# Altium schematic sheet MLVDS_Transceivers.SchDoc: RFSoC AMC
size 420 x 297 mm; CompanyName: WUT; DrawnBy: T. Przywozki; Organization: WUT ISE; Address1: Warsaw University of Technology; Address2: Nowowiejska 15/19 00-665 Warsaw; Address3: Tomasz.Przywozki@pw.edu.pl; DocumentNumber: 44; Revision: 1; SheetNumber: 44; SheetTotal: 45; Project: RFSoC AMC; ModifiedBy: T. Przywozki; CreateDate: -; CheckedDate: -; DivGrp: ISE; Designer: T. Przywozki; ModifiedDate: -; ProjectName: ADC/DAC MEZZANINE
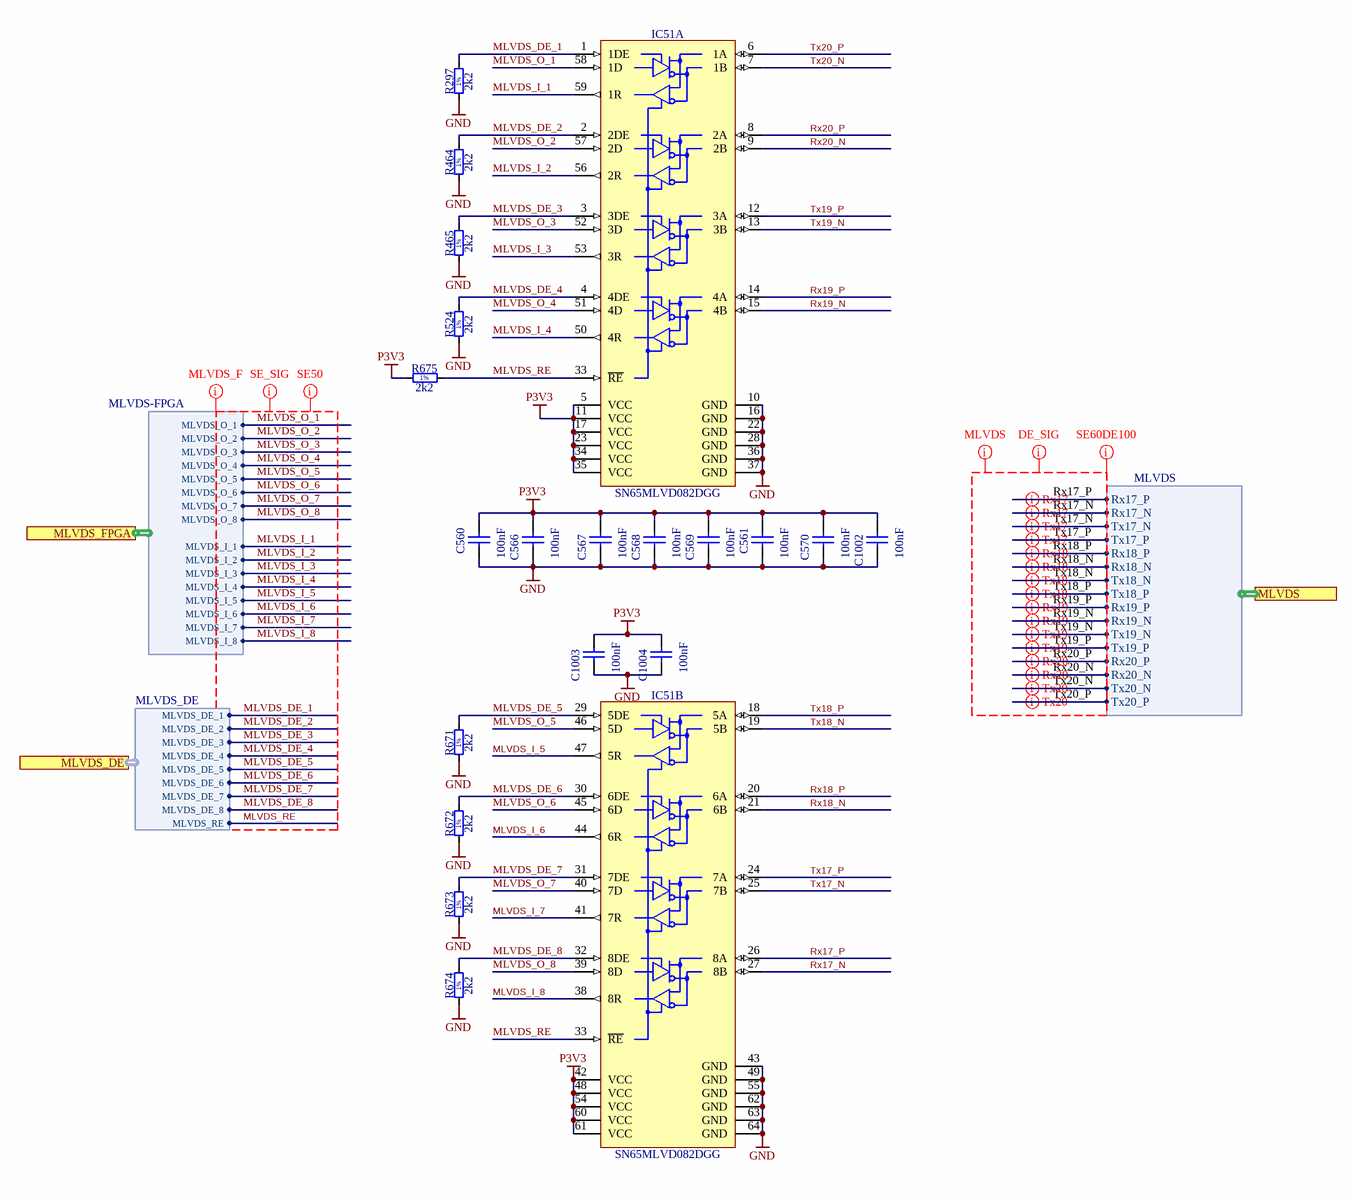
[diagram p0: MLVDS_Transceivers.SchDoc]

## Parts
C560  100nF  [CAPC0603X33N]
C561  100nF  [CAPC0603X33N]
C566  100nF  [CAPC0603X33N]
C567  100nF  [CAPC0603X33N]
C568  100nF  [CAPC0603X33N]
C569  100nF  [CAPC0603X33N]
C570  100nF  [CAPC0603X33N]
C1002  100nF  [CAPC0603X33N]
C1003  100nF  [CAPC0603X33N]
C1004  100nF  [CAPC0603X33N]
IC51  SN65MLVD082DGG  [SOP50P810X120-64N]  (parts A,B of 2)
R297  2k2  [RESC1005X40N]
R464  2k2  [RESC1005X40N]
R465  2k2  [RESC1005X40N]
R524  2k2  [RESC1005X40N]
R671  2k2  [RESC1005X40N]
R672  2k2  [RESC1005X40N]
R673  2k2  [RESC1005X40N]
R674  2k2  [RESC1005X40N]
R675  2k2  [RESC1005X40N]

## Ports
MLVDS (harness MLVDS), MLVDS_DE (harness MLVDS_DE), MLVDS_FPGA (harness MLVDS-FPGA)

## Harnesses
MLVDS: Rx17_P, Rx17_N, Tx17_N, Tx17_P, Rx18_P, Rx18_N, Tx18_N, Tx18_P, Rx19_P, Rx19_N, Tx19_N, Tx19_P, Rx20_P, Rx20_N, Tx20_N, Tx20_P
MLVDS-FPGA: MLVDS_O_1, MLVDS_O_2, MLVDS_O_3, MLVDS_O_4, MLVDS_O_5, MLVDS_O_6, MLVDS_O_7, MLVDS_O_8, MLVDS_I_1, MLVDS_I_2, MLVDS_I_3, MLVDS_I_4, MLVDS_I_5, MLVDS_I_6, MLVDS_I_7, MLVDS_I_8
MLVDS_DE: MLVDS_DE_1, MLVDS_DE_2, MLVDS_DE_3, MLVDS_DE_4, MLVDS_DE_5, MLVDS_DE_6, MLVDS_DE_7, MLVDS_DE_8, MLVDS_RE

## Nets
GND: C560.2 C561.2 C566.2 C567.2 C568.2 C569.2 C570.2 C1002.2 C1003.2 C1004.2 IC51.10(GND) IC51.16(GND) IC51.22(GND) IC51.28(GND) IC51.36(GND) IC51.37(GND) IC51.43(GND) IC51.49(GND) IC51.55(GND) IC51.62(GND) IC51.63(GND) IC51.64(GND) R297.1 R464.1 R465.1 R524.1 R671.1 R672.1 R673.1 R674.1
P3V3: C560.1 C561.1 C566.1 C567.1 C568.1 C569.1 C570.1 C1002.1 C1003.1 C1004.1 IC51.5(VCC) IC51.11(VCC) IC51.17(VCC) IC51.23(VCC) IC51.34(VCC) IC51.35(VCC) IC51.42(VCC) IC51.48(VCC) IC51.54(VCC) IC51.60(VCC) IC51.61(VCC) R675.1
MLVDS_DE_1: IC51.1(1DE) R297.2 ; port MLVDS_DE.MLVDS_DE_1
MLVDS_DE_2: IC51.2(2DE) R464.2 ; port MLVDS_DE.MLVDS_DE_2
MLVDS_DE_3: IC51.3(3DE) R465.2 ; port MLVDS_DE.MLVDS_DE_3
MLVDS_DE_4: IC51.4(4DE) R524.2 ; port MLVDS_DE.MLVDS_DE_4
MLVDS_DE_5: IC51.29(5DE) R671.2 ; port MLVDS_DE.MLVDS_DE_5
MLVDS_DE_6: IC51.30(6DE) R672.2 ; port MLVDS_DE.MLVDS_DE_6
MLVDS_DE_7: IC51.31(7DE) R673.2 ; port MLVDS_DE.MLVDS_DE_7
MLVDS_DE_8: IC51.32(8DE) R674.2 ; port MLVDS_DE.MLVDS_DE_8
MLVDS_I_1: IC51.59(1R) ; port MLVDS_FPGA.MLVDS_I_1
MLVDS_I_2: IC51.56(2R) ; port MLVDS_FPGA.MLVDS_I_2
MLVDS_I_3: IC51.53(3R) ; port MLVDS_FPGA.MLVDS_I_3
MLVDS_I_4: IC51.50(4R) ; port MLVDS_FPGA.MLVDS_I_4
MLVDS_I_5: IC51.47(5R) ; port MLVDS_FPGA.MLVDS_I_5
MLVDS_I_6: IC51.44(6R) ; port MLVDS_FPGA.MLVDS_I_6
MLVDS_I_7: IC51.41(7R) ; port MLVDS_FPGA.MLVDS_I_7
MLVDS_I_8: IC51.38(8R) ; port MLVDS_FPGA.MLVDS_I_8
MLVDS_O_1: IC51.58(1D) ; port MLVDS_FPGA.MLVDS_O_1
MLVDS_O_2: IC51.57(2D) ; port MLVDS_FPGA.MLVDS_O_2
MLVDS_O_3: IC51.52(3D) ; port MLVDS_FPGA.MLVDS_O_3
MLVDS_O_4: IC51.51(4D) ; port MLVDS_FPGA.MLVDS_O_4
MLVDS_O_5: IC51.46(5D) ; port MLVDS_FPGA.MLVDS_O_5
MLVDS_O_6: IC51.45(6D) ; port MLVDS_FPGA.MLVDS_O_6
MLVDS_O_7: IC51.40(7D) ; port MLVDS_FPGA.MLVDS_O_7
MLVDS_O_8: IC51.39(8D) ; port MLVDS_FPGA.MLVDS_O_8
MLVDS_RE: IC51.33(~{RE}) R675.2 ; port MLVDS_DE.MLVDS_RE
Rx17_N: IC51.27(8B) ; port MLVDS.Rx17_N
Rx17_P: IC51.26(8A) ; port MLVDS.Rx17_P
Rx18_N: IC51.21(6B) ; port MLVDS.Rx18_N
Rx18_P: IC51.20(6A) ; port MLVDS.Rx18_P
Rx19_N: IC51.15(4B) ; port MLVDS.Rx19_N
Rx19_P: IC51.14(4A) ; port MLVDS.Rx19_P
Rx20_N: IC51.9(2B) ; port MLVDS.Rx20_N
Rx20_P: IC51.8(2A) ; port MLVDS.Rx20_P
Tx17_N: IC51.25(7B) ; port MLVDS.Tx17_N
Tx17_P: IC51.24(7A) ; port MLVDS.Tx17_P
Tx18_N: IC51.19(5B) ; port MLVDS.Tx18_N
Tx18_P: IC51.18(5A) ; port MLVDS.Tx18_P
Tx19_N: IC51.13(3B) ; port MLVDS.Tx19_N
Tx19_P: IC51.12(3A) ; port MLVDS.Tx19_P
Tx20_N: IC51.7(1B) ; port MLVDS.Tx20_N
Tx20_P: IC51.6(1A) ; port MLVDS.Tx20_P

## Layout directives
differential pair: Rx17_N, Rx17_P, Rx18_N, Rx18_P, Rx19_N, Rx19_P, Rx20_N, Rx20_P, Tx17_N, Tx17_P, Tx18_N, Tx18_P, Tx19_N, Tx19_P, Tx20_N, Tx20_P
net class MLVDS: Rx17_N, Rx17_P, Rx18_N, Rx18_P, Rx19_N, Rx19_P, Rx20_N, Rx20_P, Tx17_N, Tx17_P, Tx18_N, Tx18_P, Tx19_N, Tx19_P, Tx20_N, Tx20_P
net class DE_SIG: Rx17_N, Rx17_P, Rx18_N, Rx18_P, Rx19_N, Rx19_P, Rx20_N, Rx20_P, Tx17_N, Tx17_P, Tx18_N, Tx18_P, Tx19_N, Tx19_P, Tx20_N, Tx20_P
net class SE60DE100: Rx17_N, Rx17_P, Rx18_N, Rx18_P, Rx19_N, Rx19_P, Rx20_N, Rx20_P, Tx17_N, Tx17_P, Tx18_N, Tx18_P, Tx19_N, Tx19_P, Tx20_N, Tx20_P
net class MLVDS_F: MLVDS_DE_1, MLVDS_DE_2, MLVDS_DE_3, MLVDS_DE_4, MLVDS_DE_5, MLVDS_DE_6, MLVDS_DE_7, MLVDS_DE_8, MLVDS_I_1, MLVDS_I_2, MLVDS_I_3, MLVDS_I_4, MLVDS_I_5, MLVDS_I_6, MLVDS_I_7, MLVDS_I_8, MLVDS_O_1, MLVDS_O_2, MLVDS_O_3, MLVDS_O_4, MLVDS_O_5, MLVDS_O_6, MLVDS_O_7, MLVDS_O_8, MLVDS_RE
net class SE50: MLVDS_DE_1, MLVDS_DE_2, MLVDS_DE_3, MLVDS_DE_4, MLVDS_DE_5, MLVDS_DE_6, MLVDS_DE_7, MLVDS_DE_8, MLVDS_I_1, MLVDS_I_2, MLVDS_I_3, MLVDS_I_4, MLVDS_I_5, MLVDS_I_6, MLVDS_I_7, MLVDS_I_8, MLVDS_O_1, MLVDS_O_2, MLVDS_O_3, MLVDS_O_4, MLVDS_O_5, MLVDS_O_6, MLVDS_O_7, MLVDS_O_8, MLVDS_RE
net class SE_SIG: MLVDS_DE_1, MLVDS_DE_2, MLVDS_DE_3, MLVDS_DE_4, MLVDS_DE_5, MLVDS_DE_6, MLVDS_DE_7, MLVDS_DE_8, MLVDS_I_1, MLVDS_I_2, MLVDS_I_3, MLVDS_I_4, MLVDS_I_5, MLVDS_I_6, MLVDS_I_7, MLVDS_I_8, MLVDS_O_1, MLVDS_O_2, MLVDS_O_3, MLVDS_O_4, MLVDS_O_5, MLVDS_O_6, MLVDS_O_7, MLVDS_O_8, MLVDS_RE

## Notes on the sheet
- Project/Equipment
- Document
- Designer
- Drawn by
- Check.by
- Copyright WUT ISE 2021
  This documentation describes Open Hardware and is licensed under CERN OHL v.1.1. You may redistribute and modify this documentaction under the terms of the CERN OHL v1.1.
  (http://ohwr.org/CERNOHL). This documentation is dristributed WITHOUT ANY EXPRESS OR IMPLIED WARRANTY, INCLUDING OF MERCHANTABLITY, SATISFACTORY QUALITY AND FITNESS FOR A PARTICULAR PURPOSE. Please see the CERN OHL v.1.1 for applicable conditions
- File
- Last Mod.
- Print Date
- Sheet
- Size
- A3
- of
- Rev
- Contact:
- (in symbol R0402_2K2_1%_0.0625W_100PPM) 1%

## Library data of the parts
C560 C561 C566-C570 C1002-C1004 = CC0201_100NF_6.3V_10%_X5R: Non-polarised capacitor; Manufacturer: GENERIC; Manufacturer1 Part Number: 02016D104KAT2A; Part Description: SMD Multilayer Chip Ceramic Capacitor; TC: X5R; Tolerance: ±10%; Voltage: 6.3V; Author: CERN DEM JLC; Case: 0201; Component Kind: Standard; Component Type: Standard; CreateDate: 03/12/2007; HelpURL: \\cern.ch\dfs\Applications\Altium\Datasheets\CC0201_X5R_AVX.pdf; LatestRevisionDate: 03/12/2007; Manufacturer Part Number: CC0201_100NF_6.3V_10%_X5R; Manufacturer1 ComponentHeight: 0.33mm; Manufacturer1 Example: AVX; Mounted: Yes; Part Number: CC0201_100NF_6.3V_10%_X5R; Pin Count: 2; SMD: Yes; Socket: No; Status: Not Recommended; Value: 100nF; Sense: No
IC51 = SN65MLVD082DGG: 8-Channel Half-Duplex M-LVDS Line Transceiver; Manufacturer: TEXAS INSTRUMENTS; PressFit: No; Bonding: No; Part Number: SN65MLVD082DGG; Component Kind: Standard; Component Type: Standard; Device: SN65MLVD082DGG; PackageDescription: SOP, 0.50mm Pitch, 64 Pin, 6.10mm W X 17.0mm L X 1.20mm H body, IPC Medium Density; Part Description: 8-Channel Half-Duplex M-LVDS Line Transceiver; Manufacturer Part Number: SN65MLVD082DGG; Pin Count: 64; Case: TSSOP64; Mounted: Yes; Socket: No; SMD: Yes; Sense: No; ComponentHeight: 1.2mm; Author: CERN DEM BC; HelpURL: \\cern.ch\dfs\Applications\Altium\Datasheets\SN65MLVD082DGG.pdf; CreateDate: 15.07.2020; LatestRevisionDate: 15.07.2020
R297 R464 R465 R524 R671-R675 = R0402_2K2_1%_0.0625W_100PPM: Resistor - 1%; Part Description: General Purpose Thick Film Chip Resistor; Manufacturer: GENERIC; Manufacturer1 Part Number: 232270672202L; TC: ±100ppm/°C; PressFit: No; Part Number: R0402_2K2_1%_0.0625W_100PPM; Component Kind: Standard; Component Type: Standard; Pin Count: 2; Value: 2k2; Status: Not Recommended; Power: 0.0625W; Tolerance: ±1%; Manufacturer Part Number: R0402_2K2_1%_0.0625W_100PPM; Case: 0402; Mounted: Yes; Sense: No; Socket: No; SMD: Yes; Manufacturer1 Example: YAGEO PHYCOMP; Manufacturer1 ComponentHeight: 0.4mm; HelpURL: \\cern.ch\dfs\Applications\Altium\Datasheets\R0402_Phycomp_RC0402.pdf; Author: CERN DEM JLC; CreateDate: 03.12.2007; LatestRevisionDate: 17.10.2012